# EAGLE design 32u4AVR (EAGLE 9.2.2)
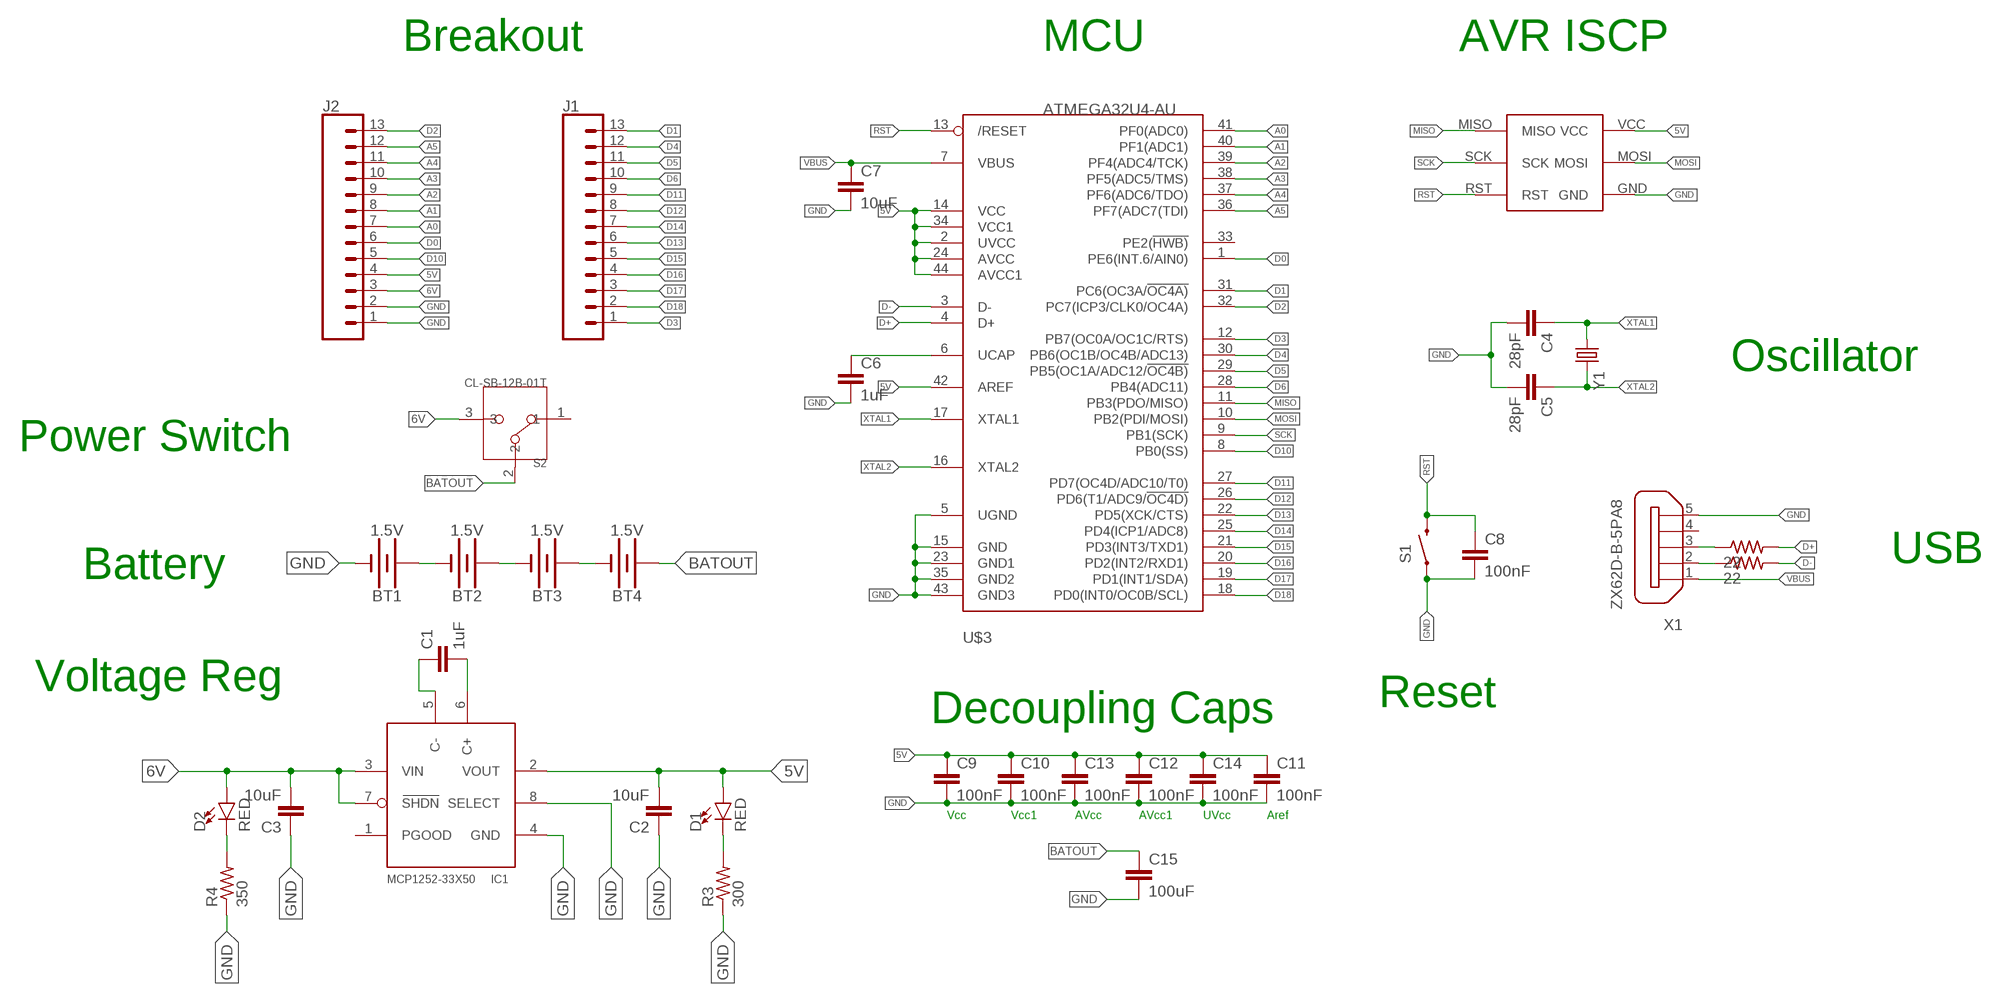
[diagram p0: schematic, sheet 1]

## Parts
BT1  1.5V  BATTERY-AA  [BATTERY-AA]
BT2  1.5V  BATTERY-AA  [BATTERY-AA]
BT3  1.5V  BATTERY-AA  [BATTERY-AA]
BT4  1.5V  BATTERY-AA  [BATTERY-AA]
C1  1uF  C-EUC0402K  [C0402K]
C2  10uF  C-EUC0402K  [C0402K]
C3  10uF  C-EUC0402K  [C0402K]
C4  28pF  C-EUC0402K  [C0402K]
C5  28pF  C-EUC0402K  [C0402K]
C6  1uF  C-EUC0402K  [C0402K]
C7  10uF  C-EUC0402K  [C0402K]
C8  100nF  C-EUC0402K  [C0402K]
C9  100nF  C-EUC0402K  [C0402K]
C10  100nF  C-EUC0402K  [C0402K]
C11  100nF  C-EUC0402K  [C0402K]
C12  100nF  C-EUC0402K  [C0402K]
C13  100nF  C-EUC0402K  [C0402K]
C14  100nF  C-EUC0402K  [C0402K]
C15  100uF  C-EUC1206K  [C1206K]
D1  RED  LED-RED0603  [LED-0603]
D2  RED  LED-RED0603  [LED-0603]
IC1  MCP1252-33X50  [MSOP8]
J1  CONN_13LONGPADS  [1X13-LONGPADS]
J2  CONN_13LONGPADS  [1X13-LONGPADS]
R3  300  R-US_R0402  [R0402]
R4  350  R-US_R0402  [R0402]
R5  22  R-US_R0402  [R0402]
R6  22  R-US_R0402  [R0402]
S1  SWITCH-MOMENTARY-2SMD  [TACTILE-SWITCH-SMD]
S2  CL-SB-12B-01T  [CL-SB-12B]
U$1  AVR-ISP  [AVR-ISP]
U$3  ATMEGA32U4-AU  [TQFP44]
X1  ZX62D-B-5PA8  [ZX62D-B-5PA8]
Y1  CRYSTALSMD  [HC49UP]

## Nets
5V: C2.2 C9.1 C10.1 C11.1 C12.1 C13.1 C14.1 D1.A IC1.2(VOUT) J2.4 U$1.VCC U$3.2(UVCC) U$3.14(VCC) U$3.24(AVCC) U$3.34(VCC1) U$3.42(AREF) U$3.44(AVCC1)
6V: C3.2 D2.A IC1.3(VIN) IC1.7(SHDN) J2.3 S2.3
A0: J2.7 U$3.41(PF0(ADC0))
A1: J2.8 U$3.40(PF1(ADC1))
A2: J2.9 U$3.39(PF4(ADC4/TCK))
A3: J2.10 U$3.38(PF5(ADC5/TMS))
A4: J2.11 U$3.37(PF6(ADC6/TDO))
A5: J2.12 U$3.36(PF7(ADC7(TDI))
BATOUT: BT4.PWR@1(+) C15.1 S2.2
D0: J2.6 U$3.1(PE6(INT.6/AIN0))
D1: J1.13 U$3.31(PC6(OC3A/!OC4A))
D2: J2.13 U$3.32(PC7(ICP3/CLK0/OC4A))
D3: J1.1 U$3.12(PB7(OC0A/OC1C/RTS))
D4: J1.12 U$3.30(PB6(OC1B/OC4B/ADC13))
D5: J1.11 U$3.29(PB5(OC1A/ADC12/!OC4B))
D6: J1.10 U$3.28(PB4(ADC11))
D10: J2.5 U$3.8(PB0(SS))
D11: J1.9 U$3.27(PD7(OC4D/ADC10/T0))
D12: J1.8 U$3.26(PD6(T1/ADC9/!OC4D))
D13: J1.6 U$3.22(PD5(XCK/CTS))
D14: J1.7 U$3.25(PD4(ICP1/ADC8))
D15: J1.5 U$3.21(PD3(INT3/TXD1))
D16: J1.4 U$3.20(PD2(INT2/RXD1))
D17: J1.3 U$3.19(PD1(INT1/SDA))
D18: J1.2 U$3.18(PD0(INT0/OC0B/SCL))
D+: R5.2 U$3.4(D+)
D-: R6.2 U$3.3(D-)
GND: BT1.GND@1(-) C2.1 C3.1 C4.2 C5.2 C6.2 C7.2 C8.2 C9.2 C10.2 C11.2 C12.2 C13.2 C14.2 C15.2 IC1.4(GND) IC1.8(SELECT) J2.1 J2.2 R3.1 R4.1 S1.1 U$1.GND U$3.5(UGND) U$3.15(GND) U$3.23(GND1) U$3.35(GND2) U$3.43(GND3) X1.5
MISO: U$1.MISO U$3.11(PB3(PDO/MISO))
MOSI: U$1.MOSI U$3.10(PB2(PDI/MOSI))
N$1: C1.1 IC1.5(C-)
N$2: C1.2 IC1.6(C+)
N$3: BT1.PWR@1(+) BT2.GND@1(-)
N$4: BT2.PWR@1(+) BT3.GND@1(-)
N$5: BT3.PWR@1(+) BT4.GND@1(-)
N$6: R6.1 X1.2
N$7: R5.1 X1.3
N$8: C6.1 U$3.6(UCAP)
N$9: D1.C R3.2
N$10: D2.C R4.2
RST: C8.1 S1.3 U$1.RST U$3.13(/RESET)
SCK: U$1.SCK U$3.9(PB1(SCK))
VBUS: C7.1 U$3.7(VBUS) X1.1
XTAL1: C4.1 U$3.17(XTAL1) Y1.1
XTAL2: C5.1 U$3.16(XTAL2) Y1.2
Unconnected: IC1.1(PGOOD) S2.1 U$3.33(PE2(!HWB)) X1.4 X1.S1 X1.S2 X1.S3 X1.S4

## Notes on the sheet
- Breakout | MCU | AVR ISCP
- Oscillator
- Power Switch
- USB
- Battery
- Voltage Reg
- Reset
- Decoupling Caps
- Vcc | Vcc1 | AVcc | AVcc1 | UVcc | Aref

## Library data of the parts
BT1-BT4 = SparkFun-Batteries:BATTERY: Battery - Single Cell A variety of battery chemistries, sizes, and footprints. Device List: 20MM_PTH - Coin Cell Battery Holder - 20mm (PTH) <https://www.sparkfun.com/products/783> 6.8MM_PTH - Coin Cell Battery Holder - 6.8MM(SMD) <https://www.digikey.com/product-detail/en/seiko-instruments/MS621FE-FL11E/728-1057-ND/1889208?WT.srch=1&gclid=CNOQ5a6LzdQCFZS2wAodXCkE0g> 12MM_SMD - Coin Cell Battery Holder - 12mm (SMD) <https://www.sparkfun.com/products/10592> 12MM_PTH - Coin Cell Battery Holder - 12mm (PTH) <https://www.sparkfun.com/products/7948> 20MM_SMD - 20mm Coin Cell Battery Holder (SMD) (2 legs) Used on the Big Time Watch Kit <https://www.sparkfun.com/products/11734> 20MM_SMD_4LEGS - Coin Cell Battery Holder - 20mm (SMD) <https://www.sparkfun.com/products/11892> 20MM_SMD_4LEGS_OVERPASTE - Coin Cell Battery Holder - 20mm (SMD) <https://www.sparkfun.com/products/11892> (Over-paste on the legs) 24.5MM_PTH - Coin Cell Battery Holder - 24.5mm (PTH) <https://www.sparkfun.com/products/8863> 9V - 9V Battery Holder - PC Mount Used on the SparkFun SparkPunk Sound Kit <https://www.sparkfun.com/products/11177> and SparkFun SparkPunk Sequencer Kit <https://www.sparkfun.com/products/12707> 18650 - Battery Holder - 18650 (PTH) <https://www.sparkfun.com/products/13113> AA - Battery Holder - 1xAA (PTH) <https://www.sparkfun.com/products/7949> AAA - Battery Holder - 1xAAA (PTH) <https://www.sparkfun.com/products/12718> AA_KIT - Battery Holder - 1xAA (PTH) <https://www.sparkfun.com/products/7949> Special kit package - pads only have exposed copper on one side of the board. AAA_KIT - Battery Holder - 1xAAA (PTH) <https://www.sparkfun.com/products/12718> Special kit package - pads only have exposed copper on one side of the board.; PROD_ID: BATT-08316; SF_SKU: PRT-07949
C1-C15 = resistor:C-EU: CAPACITOR, European symbol
D1 D2 = SparkFun-LED:LED-RED: Red SMD LED Used in manufacturing of most products at SparkFun Packages: 0603 - SMD 0603 package [Product Link] <http://docs.avagotech.com/docs/AV02-0551EN> 0603 SMART - SMD 0603 SMART package ( more efficient and expensive)[Product Link] <http://www.osram-os.com/Graphics/XPic2/00077099_0.pdf> 1206 - SMD1206 package [Product Link] <https://www.sparkfun.com/datasheets/DevTools/LilyPad/Q150OVS4.pdff> SparkFun Products: Pro Mini 328 -5V <https://www.sparkfun.com/products/821> RedBoard <https://www.sparkfun.com/products/12757> IOIO-OTG <https://www.sparkfun.com/products/13613>; PROD_ID: DIO-00819
IC1 = microchip-MCP125x-xxx:MCP1252-33X50: 650KHz 3.3V / 5.0V Selectable Switching Regulator
J1 J2 = SparkFun-Connectors:CONN_13: Multi connection point. Often used as Generic Header-pin footprint for 0.1 inch spaced/style header connections On any of the 0.1 inch spaced packages, you can populate with these: Break Away Headers - Straight <https://www.sparkfun.com/products/116> (PRT-00116) Break Away Male Headers - Right Angle <https://www.sparkfun.com/products/553> (PRT-00553) Female Headers <https://www.sparkfun.com/products/115> (PRT-00115) Break Away Headers - Machine Pin <https://www.sparkfun.com/products/117> (PRT-00117) Break Away Female Headers - Swiss Machine Pin <https://www.sparkfun.com/products/743> (PRT-00743) For SCREWTERMINALS and SPRING TERMINALS visit here: Screw Terimnals on SparkFun.com <https://www.sparkfun.com/search/results?term=Screw+Terminals> (5mm/3.5mm/2.54mm spacing) This device is also useful as a general connection point to wire up your design to another part of your project. Our various solder wires solder well into these plated through hole pads. Hook-Up Wire - Assortment (Stranded, 22 AWG) <https://www.sparkfun.com/products/11375> (PRT-11375) Hook-Up Wire - Assortment (Solid Core, 22 AWG) <https://www.sparkfun.com/products/11367> (PRT-11367) View the entire wire category on our website here <https://www.sparkfun.com/categories/141> Special notes: Molex polarized connector foot print use with SKU : PRT-08231 with associated crimp pins and housings. 1MM SMD Version SKU: PRT-10208 NOTES ON THE VARIANTS LOCK and LOCK_LONGPADS... This footprint was designed to help hold the alignment of a through-hole component (i.e. 6-pin header) while soldering it into place. You may notice that each hole has been shifted either up or down by 0.005 of an inch from it's more standard position (which is a perfectly straight line). This slight alteration caused the pins (the squares in the middle) to touch the edges of the holes. Because they are alternating, it causes a "brace" to hold the component in place. 0.005 has proven to be the perfect amount of "off-center" position when using our standard breakaway headers. Although looks a little odd when you look at the bare footprint, once you have a header in there, the alteration is very hard to notice. Also,if you push a header all the way into place, it is covered up entirely on the bottom side.
R3-R6 = resistor:R-US_: RESISTOR, American symbol
S1 = AP_quad:SWITCH-MOMENTARY-2: Various NO switches- pushbuttons, reed, etc; PROD_ID: SWCH-08247
S2 = CL-SB-12B-01T:CL-SB-12B-01T; AVAILABILITY: Unavailable; DESCRIPTION: Switch Slide N.O./N.C. SPDT Top Slide 0.2A 12VDC Gull Wing SMD T/R; MF: Nidec Copal; MP: CL-SB-12B-01T; PACKAGE: None; PRICE: None
U$1 = AVR-ISP:AVR-ISP; AVAILABILITY: Unavailable; DESCRIPTION: Emulators / Simulators AVR USB IN CIRCUIT EMUL/PRGMR ISP; MF: Gravitech; MP: AVR-ISP; PACKAGE: None; PRICE: None
U$3 = adafruit:ATMEGA32U4: http://www.ladyada.net/library/eagle
X1 = zx62d-b-5pa8-oshpark_10:ZX62D-B-5PA8: Micro USB Type B Connector - Standard, Shell Through Hole Source: http://www.hirose.co.jp/cataloge_hp/ed_ZX_20140804.pdf; MF: Hirose; MPN: ZX62D-B-5PA8; OC_FARNELL: 2300438; OC_NEWARK: 69W0712
Y1 = AP_quad:CRYSTAL: Crystals Various standard crystals. Proven footprints. Spark Fun Electronics SKU : COM-00534

## Board
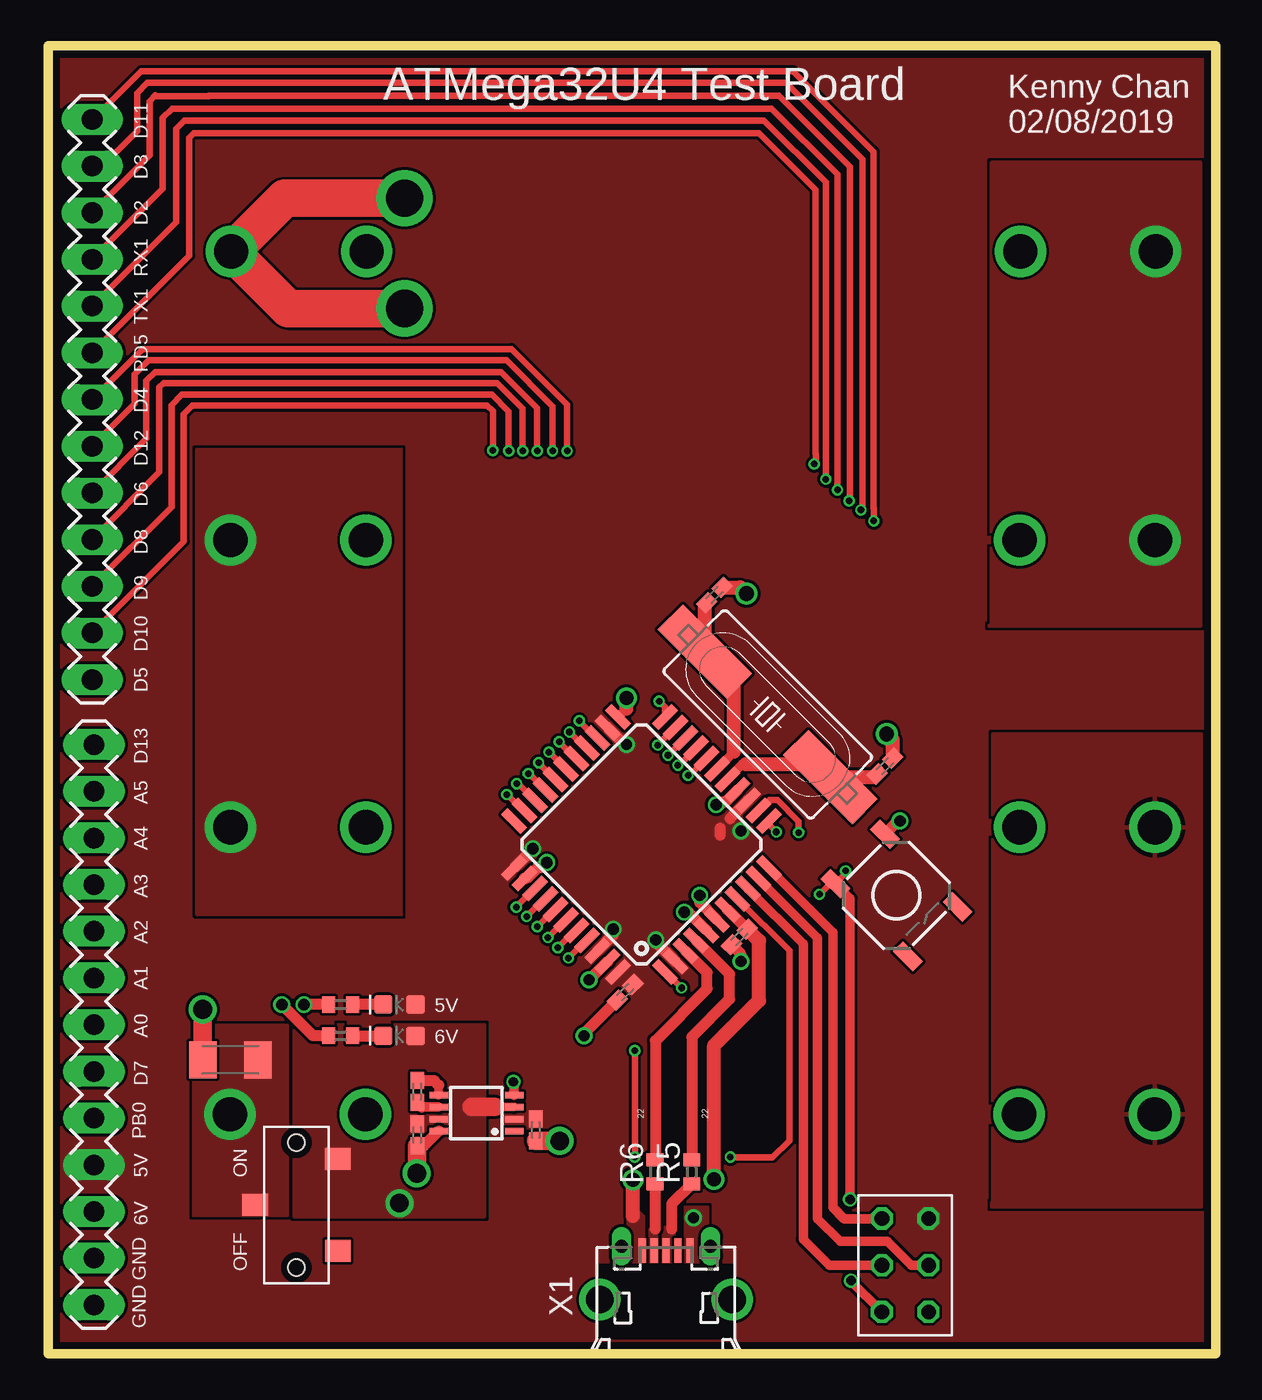
[diagram p1: board, top side]
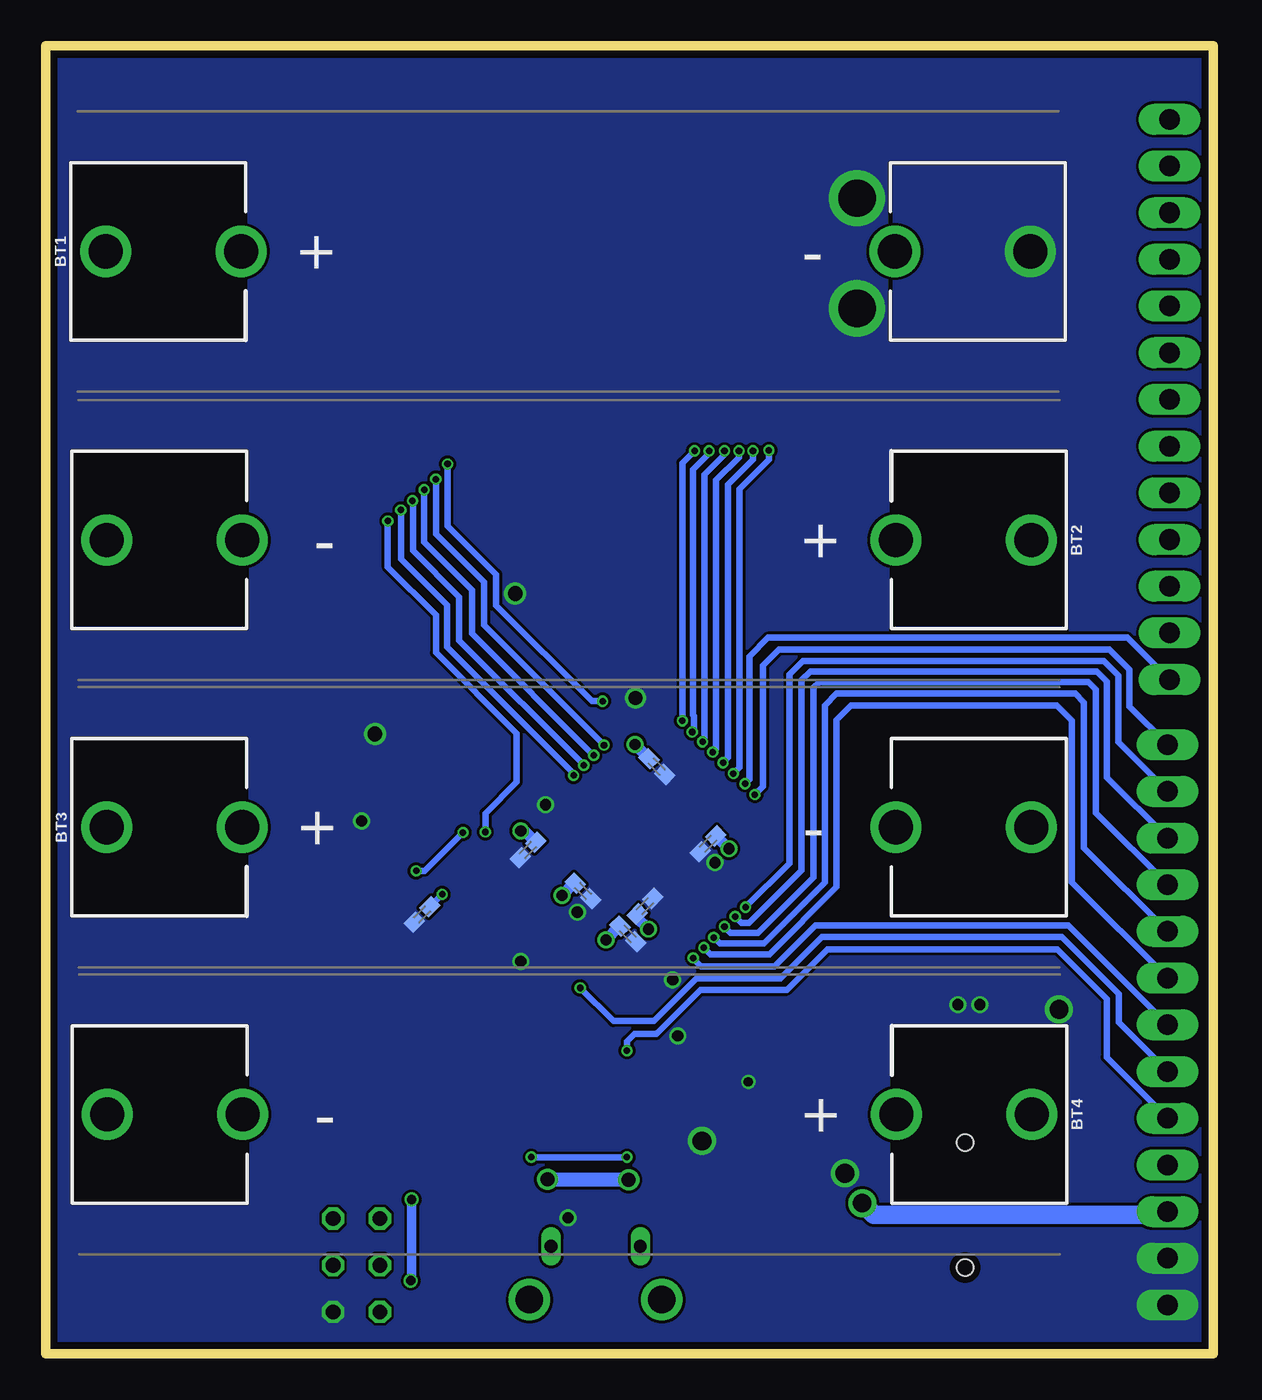
[diagram p2: board, bottom side, seen from below]

Size 63.5 x 71.12 mm. Coordinates in mm from the lower left corner, seen from the top.
Outline: 63.5,71.12 63.5,0 0,0 0,71.12 63.5,71.12
Copper layers (1*16): Top 0.035559375mm / dielectric 1.6mm / Bottom 0.035559375mm
Design rules "oshpark-2layer": minimum track width 6mil, minimum drill 10mil, track to track 6mil, track to pad 6mil, pad to pad 6mil, via to via 6mil, smd to smd 6mil, copper to edge 15mil, drill to drill 6mil, minimum pad ring 5mil, minimum via ring 5mil, stop-mask expansion 2.5mil, vias tented up to drill 0mil, thermal gap 10mil

### Footprints (pad centres in the part's own frame; a part is rotated, then mirrored left to right if it is on the bottom)
BATTERY-AA = drill 1.854: GND@1 25.146,0; GND@2 17.78,0; PWR@1 -25.146,0; PWR@2 -17.78,0
C0402K = smd 0.925 x 0.74: 1 -0.6,0; 2 0.6,0
C1206K = smd 1.5 x 2: 1 -1.5,0; 2 1.5,0
LED-0603 = smd 1 x 1: A -0.877,0; C 0.877,0
MSOP8 = smd 0.35 x 1: 1 -0.975,-2.05; 2 -0.325,-2.05; 3 0.325,-2.05; 4 0.975,-2.05; 5 0.975,2.05; 6 0.325,2.05; 7 -0.325,2.05; 8 -0.975,2.05
1X13-LONGPADS = drill 1.118 long: 1 0,0; 2 2.54,0; 3 5.08,0; 4 7.62,0; 5 10.16,0; 6 12.7,0; 7 15.24,0; 8 17.78,0; 9 20.32,0; 10 22.86,0; 11 25.4,0; 12 27.94,0; 13 30.48,0
R0402 = smd 0.7 x 0.9: 1 -0.65,0; 2 0.65,0
TACTILE-SWITCH-SMD = smd 1.524 x 0.762: 1 -2.794,1.905; 2 2.794,1.905; 3 -2.794,-1.905; 4 2.794,-1.905
CL-SB-12B = smd 1.2 x 1.4: 1 -2.5,-2.25; 2 0,2.25; 3 2.5,-2.25 | hole 0.9: 3.4,0; -3.4,0
AVR-ISP = drill 0.8 octagon: GND 2.54,1.27; MISO -2.54,-1.27; MOSI 0,1.27; RST 2.54,-1.27; SCK 0,-1.27; VCC -2.54,1.27
TQFP44 = smd 1.5 x 0.5: 1 -5.8,4; 2 -5.8,3.2; 3 -5.8,2.4; 4 -5.8,1.6; 5 -5.8,0.8; 6 -5.8,0; 7 -5.8,-0.8; 8 -5.8,-1.6; 9 -5.8,-2.4; 10 -5.8,-3.2; 11 -5.8,-4; 23 5.8,-4; 24 5.8,-3.2; 25 5.8,-2.4; 26 5.8,-1.6; 27 5.8,-0.8; 28 5.8,0; 29 5.8,0.8; 30 5.8,1.6; 31 5.8,2.4; 32 5.8,3.2; 33 5.8,4 | smd 0.5 x 1.5: 12 -4,-5.8; 13 -3.2,-5.8; 14 -2.4,-5.8; 15 -1.6,-5.8; 16 -0.8,-5.8; 17 0,-5.8; 18 0.8,-5.8; 19 1.6,-5.8; 20 2.4,-5.8; 21 3.2,-5.8; 22 4,-5.8; 34 4,5.8; 35 3.2,5.8; 36 2.4,5.8; 37 1.6,5.8; 38 0.8,5.8; 39 0,5.8; 40 -0.8,5.8; 41 -1.6,5.8; 42 -2.4,5.8; 43 -3.2,5.8; 44 -4,5.8
ZX62D-B-5PA8 = smd 1.35 x 0.4: 1 4.825,1.3; 2 4.825,0.65; 3 4.825,0; 4 4.825,-0.65; 5 4.825,-1.3 | drill 1.5: S1 2.15,-3.6; S2 2.15,3.6 | drill 0.7 long: S3 5.05,2.425; S4 5.05,-2.425
HC49UP = smd 5.334 x 1.93: 1 -4.826,0; 2 4.826,0

### Placement (x,y rotation side)
BT1  35.1,59.94 0 bottom
BT2  35.05,44.25 180 bottom
BT3  35.05,28.63 0 bottom
BT4  35.03,13 180 bottom
C1  20.07,14.25 270 top
C2  26.52,12.17 90 top
C3  20.07,11.89 90 top
C4  36.24,41.25 45 top
C5  45.5,31.95 45 top
C6  34.29,25.16 315 bottom
C7  37.58,22.67 225 top
C8  43.04,23.88 225 bottom
C9  37.28,27.39 225 bottom
C10  27.49,27.73 225 bottom
C11  30.92,24.33 45 bottom
C12  31.38,19.65 225 top
C13  31.85,22.82 315 bottom
C14  30.28,31.92 315 bottom
C15  9.9,15.98 180 top
D1  19.1,18.98 180 top
D2  19.1,17.28 180 top
IC1  23.29,13.08 90 top
J1  2.39,67.13 270 top
J2  2.49,2.64 90 top
R3  15.9,18.98 0 top
R4  15.9,17.28 0 top
R5  35,9.88 90 top
R6  33,9.88 90 top
S1  46.13,24.93 315 top
S2  13.5,8.08 90 top
U$1  46.61,4.8 270 top
U$3  32.27,27.69 135 top
X1  33.6,0.78 90 top
Y1  39.13,34.77 315 top

### Tracks (layer width: path | path; a pad name or v marks a point on that pad's centre or on a via)
5V  (via drill 0.61)
  Top 0.61: 38.05,30.09 U$3.14 37.08,29.11 37.08,29.09 | 36.54,28.57 36.54,28.19 | U$3.2 33.04,22.39 v33.04,22.5 | U$3.42 30.73,22.76 v30.73,23.09 | U$3.34 26.36,27.44 v26.36,27.46 | U$3.24 31.35,33.13 v31.46,33.13
  Bottom 0.61: v33.04,22.5 C13.1 | v30.73,23.09 31.34,23.7 C11.1 | v26.36,27.46 C10.1 | v31.46,33.13 30.7,32.38 C14.1 | C9.1 37.47,28.43 v37.67,28.43
  pour Top (rank 2, no thermals): 0.35,70.63 62.99,70.63 62.99,0.41 0.35,0.41
6V  (via drill 1.02)
  Top 0.457: IC1.3 24.27,13.41
  Top 0.61: 22.99,13.44 23.02,13.41
  Top 1.016: 23.02,13.41 24.27,13.41
  Bottom 1.016: J2.3 2.67,7.54 18.46,7.54 v19.1,8.18
  pour Top (no thermals): 13.35,17.88 13.35,7.44 23.75,7.44 23.75,17.88
A0  (via drill 0.36)
  Top 0.356: v28.3,21.51 29.24,22.46 U$3.41
  Bottom 0.356: J2.7 7.9,23.29 21.64,23.29 23.88,21.06 27.86,21.06 28.3,21.49 v28.3,21.51
A1  (via drill 0.36)
  Top 0.356: v27.71,22.07 28.66,23.02 U$3.40
  Bottom 0.356: J2.8 7.7,25.63 7.7,34.44 8.51,35.26 19.71,35.26 20.5,34.47 20.5,25.38 24.15,21.72 27.36,21.72 v27.71,22.07
A2  (via drill 0.36)
  Top 0.356: v27.18,22.63 28.14,23.59 U$3.39
  Bottom 0.356: J2.9 7.04,27.51 7.04,35.41 7.52,35.89 20.5,35.89 21.13,35.26 21.13,25.63 24.46,22.3 26.85,22.3 v27.18,22.63
A3  (via drill 0.36)
  Top 0.356: v26.59,23.22 27.53,24.16 U$3.38
  Bottom 0.356: J2.10 6.4,29.41 6.4,36.12 6.81,36.52 21.44,36.52 21.74,36.22 21.74,25.91 24.77,22.88 26.26,22.88 v26.59,23.22
A4  (via drill 0.36)
  Top 0.356: v26.02,23.77 26.97,24.72 U$3.37
  Bottom 0.356: J2.11 5.79,31.34 5.79,36.55 6.35,37.11 21.92,37.11 22.4,36.63 22.4,26.29 25.27,23.42 25.67,23.42 v26.02,23.77
A5  (via drill 0.36)
  Top 0.356: v25.45,24.28 26.46,25.29 U$3.36
  Bottom 0.356: J2.12 5.18,33.27 5.18,36.88 5.97,37.67 22.33,37.67 23.06,36.93 23.06,26.67 v25.45,24.28
BATOUT
  pour Top (no thermals): 7.9,17.88 13,17.88 13,7.48 7.9,7.48
D0  (via drill 0.36)
  Top 0.356: v34.44,19.89 33.57,20.76 U$3.1
  Bottom 0.356: J2.6 5.16,18.01 5.16,19.56 8.25,22.66 21.29,22.66 23.55,20.4 28.12,20.4 30.43,18.09 32.64,18.09 v34.44,19.89
D1  (via drill 0.36)
  Top 0.356: U$3.31 25.57,30.99 v25.48,30.99
  Bottom 0.356: J1.13 4.67,38.94 24.23,38.94 25.25,37.92 25.25,31.22 v25.48,30.99
D2  (via drill 0.36)
  Top 0.356: U$3.32 25.82,29.53 v24.94,30.4
  Bottom 0.356: J2.13 4.57,35.2 4.57,37.21 5.66,38.3 23.62,38.3 24.51,37.41 24.51,30.84 v24.94,30.4
D3  (via drill 0.36)
  Top 0.356: J1.1 2.44,67.13 5.05,69.75 40.51,69.75 44.88,65.38 44.88,46 44.9,45.98 v44.9,45.28 | v39.6,28.37 39.2,28.77 U$3.12
  Bottom 0.356: v39.6,28.37 39.6,29.38 37.9,31.09 37.9,33.73 42.29,38.12 42.29,40.16 44.91,42.77 v44.91,45.27 v44.9,45.28
D4  (via drill 0.36)
  Top 0.356: J1.12 7.37,44.17 7.37,51.1 7.82,51.56 23.88,51.56 24.18,51.26 v24.18,49.12 | U$3.30 26.15,31.55 v26.11,31.55
  Bottom 0.356: v24.18,49.12 24.18,48.62 25.78,47.02 25.78,31.88 v26.11,31.55
D5  (via drill 0.36)
  Top 0.356: U$3.29 27.54,31.28 27.53,31.28 27.52,31.28 v26.67,32.13 | J1.11 6.71,46.05 6.71,51.59 7.26,52.15 24.13,52.15 25.04,51.23 v25.04,49.1
  Bottom 0.356: v25.04,49.1 25.04,48.62 26.39,47.27 26.39,32.41 v26.67,32.13
D6  (via drill 0.36)
  Top 0.356: J1.10 6.05,47.93 6.05,52.55 6.27,52.78 24.41,52.78 25.81,51.38 v25.81,49.1 | v27.23,32.72 U$3.28
  Bottom 0.356: v25.81,49.1 25.81,48.74 27.05,47.5 27.05,32.89 v27.23,32.72
D10  (via drill 0.36)
  Top 0.356: U$3.8 40.3,21.92 40.3,11.58 39.4,10.68 v37.1,10.68 | v31.9,10.68 v31.9,16.48
  Bottom 0.356: v37.1,10.68 v31.9,10.68 | v31.9,16.48 31.9,16.98 31.5,17.38 30.3,17.38 27.9,19.78 23.2,19.78 21,21.98 8.5,21.98 5.8,19.28 5.8,16.11 J2.5
D11  (via drill 0.36)
  Top 0.356: J1.9 5.33,49.76 5.33,52.91 5.82,53.39 24.64,53.39 26.59,51.43 v26.59,49.1 | v27.79,33.27 28.7,32.36 U$3.27
  Bottom 0.356: v26.59,49.1 26.59,48.89 27.69,47.8 27.69,33.38 v27.79,33.27
D12  (via drill 0.36)
  Top 0.356: J1.8 4.7,51.66 4.7,53.26 5.46,54.03 24.92,54.03 27.43,51.51 v27.43,49.1 | v28.35,33.81 29.23,32.92 U$3.26
  Bottom 0.356: v27.43,49.1 27.43,48.95 28.3,48.08 28.3,34.73 28.25,34.68 28.25,33.91 v28.35,33.81
D13  (via drill 0.36)
  Top 0.356: J1.6 7.67,59.71 7.67,66.14 7.9,66.37 38.66,66.37 41.73,63.3 41.73,48.94 41.76,48.92 41.76,48.48 v41.66,48.38 | v33.22,35.48 33.54,35.17 U$3.22
  Bottom 0.356: v33.22,35.48 33.81,35.48 39.01,40.69 39.01,42.37 41.66,45.02 v41.66,48.38
D14  (via drill 0.36)
  Top 0.356: J1.7 5.13,54.63 25.2,54.63 28.22,51.61 v28.22,49.1 | v28.88,34.42 29.81,33.49 U$3.25
  Bottom 0.356: v28.22,49.1 28.88,48.44 v28.88,34.42
D15  (via drill 0.36)
  Top 0.356: J1.5 6.96,61.54 6.96,66.62 7.39,67.06 38.94,67.06 42.29,63.7 v42.29,47.56 | v33.15,33.1 U$3.21
  Bottom 0.356: v33.15,33.1 39.67,39.62 39.67,41.96 42.29,44.57 v42.29,47.56
D16  (via drill 0.36)
  Top 0.356: J1.4 6.22,63.35 6.22,67.21 6.73,67.72 39.34,67.72 42.93,64.14 42.93,47.83 42.92,47.82 42.93,47.82 42.93,47.29 42.92,47.29 v42.92,46.98 v42.93,46.98 | v33.71,32.54 v33.72,32.54 U$3.20
  Bottom 0.356: v33.71,32.54 40.33,39.17 40.33,41.54 42.93,44.13 v42.93,46.98
D17  (via drill 0.36)
  Top 0.356: J1.3 5.51,65.18 5.51,68.12 5.82,68.43 5.87,68.38 8.71,68.38 8.71,68.4 39.75,68.4 43.61,64.54 43.61,46.43 v43.56,46.38 | v34.25,32 34.31,32 U$3.19
  Bottom 0.356: v34.25,32 v34.25,32.01 41.02,38.79 41.02,41.15 43.54,43.66 43.54,46.35 v43.56,46.38
D18  (via drill 0.36)
  Top 0.356: J1.2 2.92,64.59 4.83,66.5 4.83,68.56 5.39,69.11 40.13,69.11 44.27,64.98 44.27,45.95 v44.2,45.88 | v34.8,31.45 34.89,31.45 U$3.18
  Bottom 0.356: v34.8,31.45 34.8,31.55 41.68,38.43 41.68,40.72 44.17,43.2 44.17,45.85 v44.2,45.88
D+
  Top 0.61: U$3.4 37.06,20.64 37.06,19.28 35,17.22 R5.2
D-
  Top 0.61: U$3.3 35.84,20.72 35.84,19.84 33.02,17.02 33.02,10.55 R6.2
GND  (via drill 0.51, 0.61, 0.76, 0.8, 1.02, 2.03)
  Top 0.508: U$3.23 31.45,35.07 | IC1.4 25.34,14.74 v25.3,14.78
  Top 0.61: U$3.35 26.03,25.85 26.63,26.45 26.86,26.45 v27.11,26.7 | U$3.15 36.84,30.01 36.7,30.01 36.54,29.85 v36.33,29.85 | S1.1 46.22,28.97 v46.33,28.97 | U$3.5 34.82,24 v34.59,24 | C7.2 37.67,21.73 v37.67,21.34 | U$3.43 29.42,20.32 v29.41,20.32 | IC1.8 20.42,11.29 C3.1 | C12.2 29.14,17.42 v29.14,17.28 | R3.1 v13.9,18.98 | R4.1 14.4,17.28 v12.7,18.98
  Top 0.762: C5.2 45.93,33.38 v45.6,33.7 | C4.2 37.64,41.67 v37.98,41.34 | 31.45,35.07 v31.45,35.66
  Top 1.016: C2.1 v27.8,11.57 v27.81,11.56 | C3.1 20.07,9.83 v20.04,9.8 | C15.2 v8.4,18.72
  Top 2.032: v19.38,56.84 13.06,56.84 BT1.GND@1 12.85,62.84 v19.38,62.84
  other vias: 35.1,7.38
  pour Bottom (no thermals): 0.4,70.63 0.4,0.53 0.38,0.51 63.04,0.51 63.09,0.46 63.09,70.63
  pour Top (no thermals): 34.6,7.98 34.6,4.88 35.9,4.88 35.9,7.98
MISO
  Top 0.508: U$3.11 39.2,26.39 42.67,22.91 42.67,7.95 43.28,7.34 U$1.MISO
MOSI
  Top 0.508: U$1.MOSI 46.94,4.8 45.64,6.1 43.08,6.1 41.83,7.34 41.83,22.61 38.63,25.81 U$3.10
N$1
  Top 0.457: IC1.5 21.24,14.6
  Top 0.61: C1.1 20.99,14.85 21.24,14.6
N$2
  Top 0.508: IC1.6 20.31,13.41
  Top 0.61: 20.31,13.41 C1.2
N$3
  pour Top (no thermals): 51.16,39.57 62.71,39.57 62.71,64.8 51.28,64.8 51.26,64.77 51.26,39.7 51.13,39.57
N$4
  pour Top (no thermals): 8.15,49.2 19.2,49.2 19.2,23.85 8.1,23.85 8.08,23.88 8.08,49.2
N$5
  pour Top: 51.28,7.98 62.74,7.98 62.74,33.71 51.36,33.71 51.36,8.28 51.31,8.23 51.31,8
N$6
  Top 0.61: R6.1 33,6.78
  pour Top (no thermals): 32.7,6.78 33.1,6.78 33.1,4.88 32.7,4.88
N$7
  Top 0.61: R5.1 33.9,8.13 33.9,6.78
  pour Top (no thermals): 33.4,6.88 33.4,4.88 34.1,4.88 34.1,6.88
N$8  (via drill 0.61)
  Top 0.61: U$3.6 35.43,24.52 v35.43,24.92
  Bottom 0.61: v35.43,24.92 34.77,25.59 C6.1
N$9
  Top 0.61: D1.C R3.2
N$10
  Top 0.61: R4.2 D2.C
RST  (via drill 0.36, 0.51)
  Top 0.356: v41.95,24.98 42.52,25.55 S1.3 43.37,26.11 v43.37,26.25 | U$3.13 39.22,30.12 39.65,30.12 40.81,28.95 v40.81,28.34
  Top 0.508: U$1.RST 43.66,3.94 v43.66,3.96 | v43.61,8.38 43.61,24.75 S1.3
  Bottom 0.356: v41.95,24.98 C8.1 | v40.81,28.34 42.9,26.25 v43.37,26.25
  Bottom 0.508: v43.61,8.38 43.61,4.01 v43.66,3.96
SCK
  Top 0.508: U$3.9 41.07,22.28 41.07,6.22 42.49,4.8 U$1.SCK
VBUS  (via drill 0.76)
  Top 0.61: C7.1 U$3.7
  Top 0.762: v36.22,9.47 36.22,16.76 38.66,19.2 38.66,22.45 38.02,23.09 C7.1 | 31.8,7.48 v31.8,9.45
  Bottom 0.762: v31.8,9.45 36.2,9.45 v36.22,9.47
  pour Top (no thermals): 31.5,7.76 32.12,7.76 32.4,7.48 32.4,4.58 31.5,4.58
XTAL1
  Top 0.508: U$3.17 37.3,32.72
  Top 0.762: 37.3,32.72 37.3,36.6 | Y1.1 35.72,40.73 C4.1
  Top 0.813: Y1.1 37.3,36.6
XTAL2
  Top 0.508: U$3.16 37.76,32.05 37.92,32.05
  Top 0.762: 37.92,32.05 41.84,32.05 Y1.2 44.91,31.35 C5.1

### Text on the board
tPlace: ATMega32U4 Test Board | D11 | Kenny Chan / 02/08/2019 | D3 | D2 | RX1 | TX1 | PD5 | D4 | D12 | D6 | D8 | D9 | D10 | D5 | D13 | A5 | A4 | A3 | A2 | A1 | 5V | A0 | 6V | D7 | 22 | 22 | PB0 | 5V | ON | 6V | GND | OFF | GND